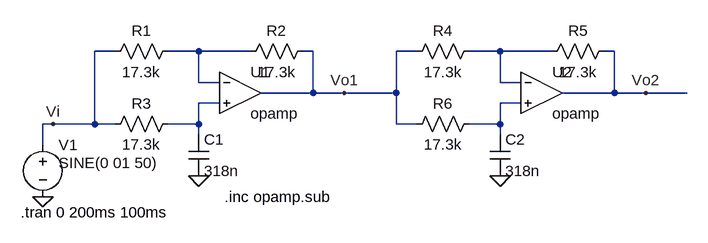
[diagram p0: schematic ej7.asc]
ej7.asc, the LTspice schematic file:
Version 4
SHEET 1 1324 680
WIRE 0 96 -32 96
WIRE 128 96 80 96
WIRE 208 96 128 96
WIRE 304 96 288 96
WIRE 464 96 432 96
WIRE 592 96 544 96
WIRE 672 96 592 96
WIRE 768 96 752 96
WIRE 128 144 128 96
WIRE 160 144 128 144
WIRE 592 144 592 96
WIRE 624 144 592 144
WIRE 304 160 304 96
WIRE 304 160 224 160
WIRE 352 160 304 160
WIRE 432 160 432 96
WIRE 432 160 352 160
WIRE 768 160 768 96
WIRE 768 160 688 160
WIRE 816 160 768 160
WIRE 880 160 816 160
WIRE 160 176 128 176
WIRE 624 176 592 176
WIRE -96 208 -112 208
WIRE -32 208 -32 96
WIRE -32 208 -96 208
WIRE 0 208 -32 208
WIRE 128 208 128 176
WIRE 128 208 80 208
WIRE 432 208 432 160
WIRE 464 208 432 208
WIRE 592 208 592 176
WIRE 592 208 544 208
WIRE 128 224 128 208
WIRE 592 224 592 208
WIRE -112 240 -112 208
FLAG 128 288 0
FLAG 352 160 Vo1
FLAG -96 208 Vi
FLAG -112 320 0
FLAG 592 288 0
FLAG 816 160 Vo2
SYMBOL OpAmps\\opamp 192 96 R0
SYMATTR InstName U1
SYMATTR SpiceLine2 GBW=10000Meg
SYMBOL res 96 80 R90
WINDOW 0 0 56 VBottom 2
WINDOW 3 32 56 VTop 2
SYMATTR InstName R1
SYMATTR Value 17.3k
SYMBOL res 304 80 R90
WINDOW 0 0 56 VBottom 2
WINDOW 3 32 56 VTop 2
SYMATTR InstName R2
SYMATTR Value 17.3k
SYMBOL res 96 192 R90
WINDOW 0 0 56 VBottom 2
WINDOW 3 32 56 VTop 2
SYMATTR InstName R3
SYMATTR Value 17.3k
SYMBOL cap 112 224 R0
SYMATTR InstName C1
SYMATTR Value 318n
SYMBOL voltage -112 224 R0
WINDOW 39 0 0 Left 0
WINDOW 3 24 44 Left 2
SYMATTR InstName V1
SYMATTR Value SINE(0 01 50)
SYMBOL OpAmps\\opamp 656 96 R0
SYMATTR InstName U2
SYMATTR SpiceLine2 GBW=10000Meg
SYMBOL res 560 80 R90
WINDOW 0 0 56 VBottom 2
WINDOW 3 32 56 VTop 2
SYMATTR InstName R4
SYMATTR Value 17.3k
SYMBOL res 768 80 R90
WINDOW 0 0 56 VBottom 2
WINDOW 3 32 56 VTop 2
SYMATTR InstName R5
SYMATTR Value 17.3k
SYMBOL res 560 192 R90
WINDOW 0 0 56 VBottom 2
WINDOW 3 32 56 VTop 2
SYMATTR InstName R6
SYMATTR Value 17.3k
SYMBOL cap 576 224 R0
SYMATTR InstName C2
SYMATTR Value 318n
TEXT 168 320 Left 2 !.inc opamp.sub
TEXT -146 344 Left 2 !.tran 0 200ms 100ms

The netlist it stands for:
* ej7.asc
XU1 N001 N003 Vo1 opamp Aol=100K GBW=10000Meg  ; pins invin noninvin out
R1 N001 Vi 17.3k
R2 Vo1 N001 17.3k
R3 N003 Vi 17.3k
C1 N003 0 318n
V1 Vi 0 SINE(0 01 50)
XU2 N002 N004 Vo2 opamp Aol=100K GBW=10000Meg  ; pins invin noninvin out
R4 N002 Vo1 17.3k
R5 Vo2 N002 17.3k
R6 N004 Vo1 17.3k
C2 N004 0 318n
.inc opamp.sub
.tran 0 200ms 100ms
.backanno
.end